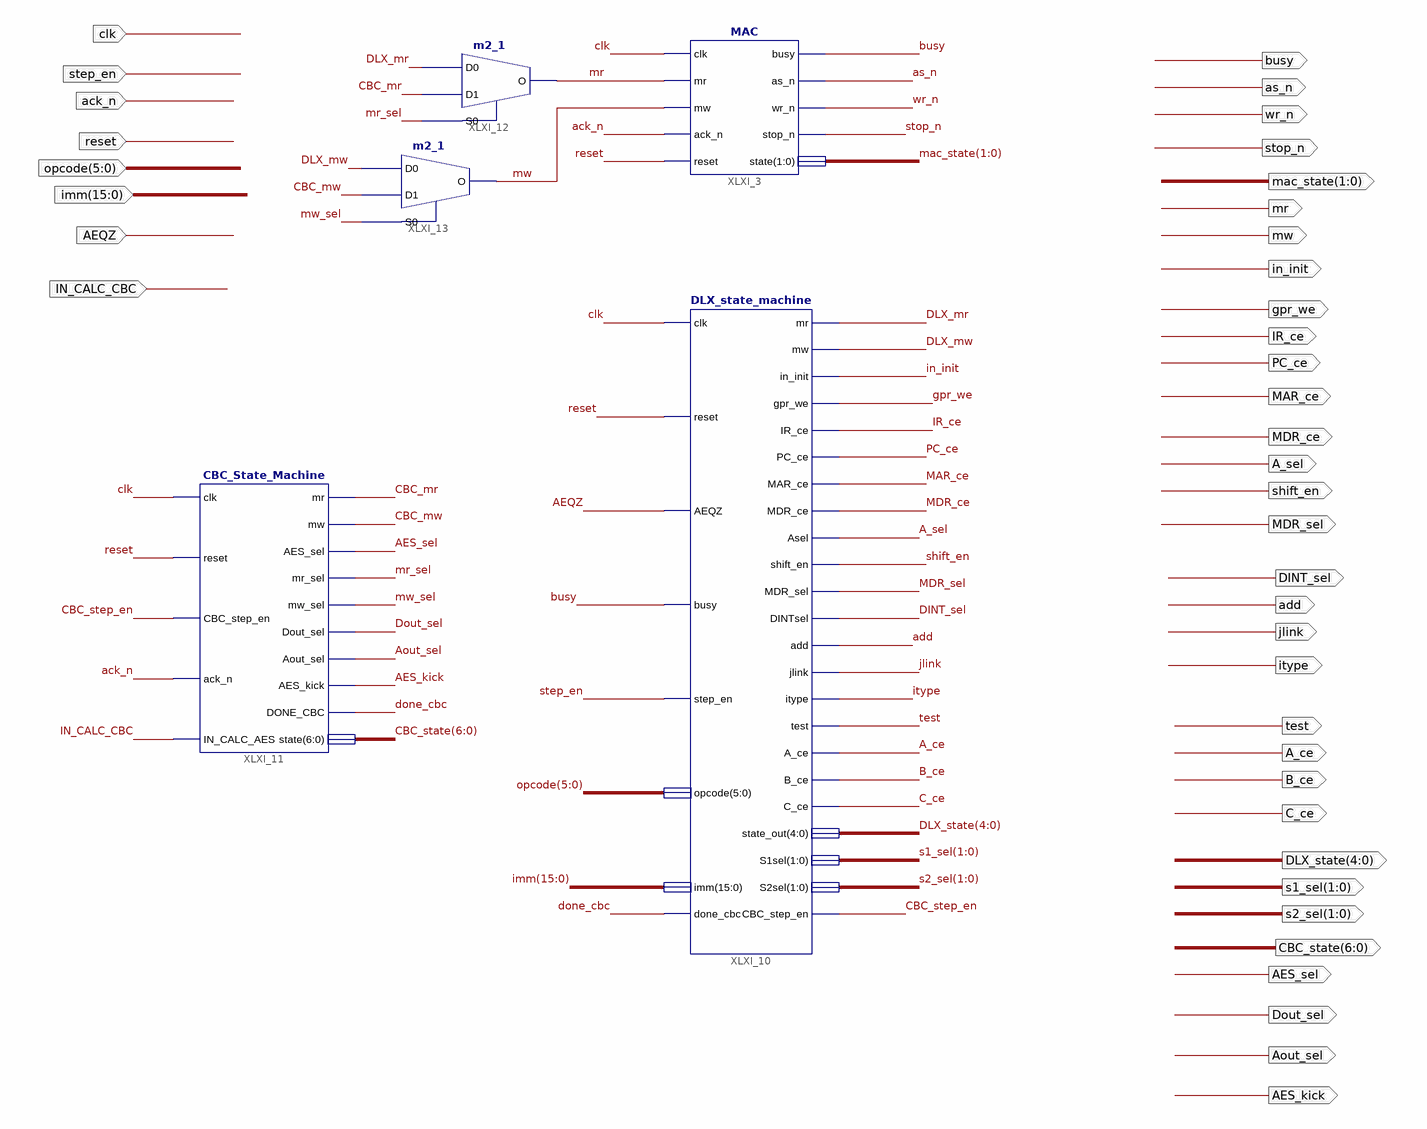
[diagram p0: schematic sheet 1]
// Xilinx ISE schematic DLX_control.sch (spartan6) as structural Verilog: 5 symbols, 40 ports
module DLX_control (
  input  clk,
  input  ack_n,
  input  step_en,
  input  reset,
  input  [5:0] opcode,
  input  AEQZ,
  input  [15:0] imm,
  input  IN_CALC_CBC,
  output [1:0] mac_state,
  output in_init,
  output gpr_we,
  output IR_ce,
  output PC_ce,
  output MAR_ce,
  output MDR_ce,
  output A_sel,
  output shift_en,
  output MDR_sel,
  output DINT_sel,
  output add,
  output jlink,
  output itype,
  output test,
  output A_ce,
  output B_ce,
  output C_ce,
  output [4:0] DLX_state,
  output [1:0] s1_sel,
  output [1:0] s2_sel,
  output busy,
  output as_n,
  output wr_n,
  output stop_n,
  output AES_sel,
  output Dout_sel,
  output Aout_sel,
  output AES_kick,
  output [6:0] CBC_state,
  output mr,
  output mw
);

  wire CBC_mr, CBC_mw, CBC_step_en, DLX_mr, DLX_mw, done_cbc, mr_sel, mw_sel;

  MAC XLXI_3 (
    .clk(clk), .mr(mr), .mw(mw), .ack_n(ack_n), .reset(reset), .busy(busy), .as_n(as_n), .wr_n(wr_n),
    .stop_n(stop_n), .state(mac_state));
  DLX_state_machine XLXI_10 (
    .clk(clk), .reset(reset), .AEQZ(AEQZ), .busy(busy), .step_en(step_en), .done_cbc(done_cbc),
    .opcode(opcode), .imm(imm), .mr(DLX_mr), .mw(DLX_mw), .in_init(in_init), .gpr_we(gpr_we), .IR_ce(IR_ce),
    .PC_ce(PC_ce), .MAR_ce(MAR_ce), .MDR_ce(MDR_ce), .Asel(A_sel), .shift_en(shift_en), .MDR_sel(MDR_sel),
    .DINTsel(DINT_sel), .add(add), .jlink(jlink), .itype(itype), .test(test), .A_ce(A_ce), .B_ce(B_ce),
    .C_ce(C_ce), .CBC_step_en(CBC_step_en), .state_out(DLX_state), .S1sel(s1_sel), .S2sel(s2_sel));
  CBC_State_Machine XLXI_11 (
    .clk(clk), .reset(reset), .CBC_step_en(CBC_step_en), .ack_n(ack_n), .IN_CALC_AES(IN_CALC_CBC),
    .mr(CBC_mr), .mw(CBC_mw), .AES_sel(AES_sel), .mr_sel(mr_sel), .mw_sel(mw_sel), .Dout_sel(Dout_sel),
    .Aout_sel(Aout_sel), .AES_kick(AES_kick), .DONE_CBC(done_cbc), .state(CBC_state));
  m2_1 XLXI_12 (.D0(DLX_mr), .D1(CBC_mr), .S0(mr_sel), .O(mr));
  m2_1 XLXI_13 (.D0(DLX_mw), .D1(CBC_mw), .S0(mw_sel), .O(mw));
endmodule
